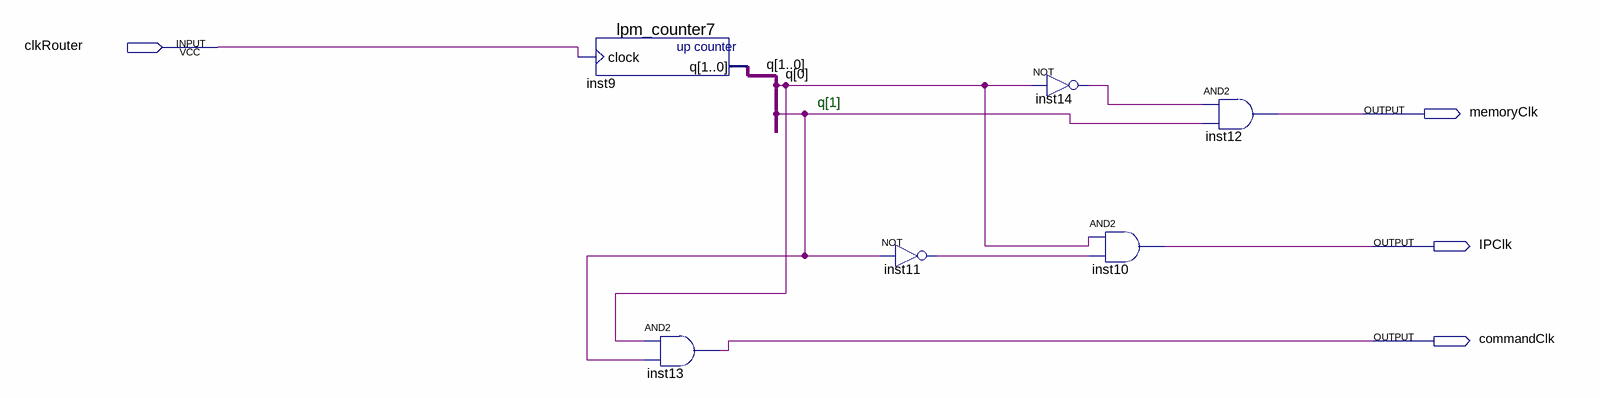
[diagram p0: schematic sheet]
// Quartus schematic clkRouter1.bdf as structural Verilog: 6 symbols, 4 pins
module clkRouter1 (
  input  clkRouter,
  output memoryClk,
  output IPClk,
  output commandClk
);

  wire inst11_out, inst14_out;
  wire [1:0] q;

  lpm_counter7 inst9 (.clock(clkRouter), .q(q));
  and inst13 (commandClk, q[0], q[1]);
  not inst11 (inst11_out, q[1]);
  not inst14 (inst14_out, q[0]);
  and inst10 (IPClk, q[0], inst11_out);
  and inst12 (memoryClk, inst14_out, q[1]);

  // Notes on the sheet:
  //   q[1]
endmodule
